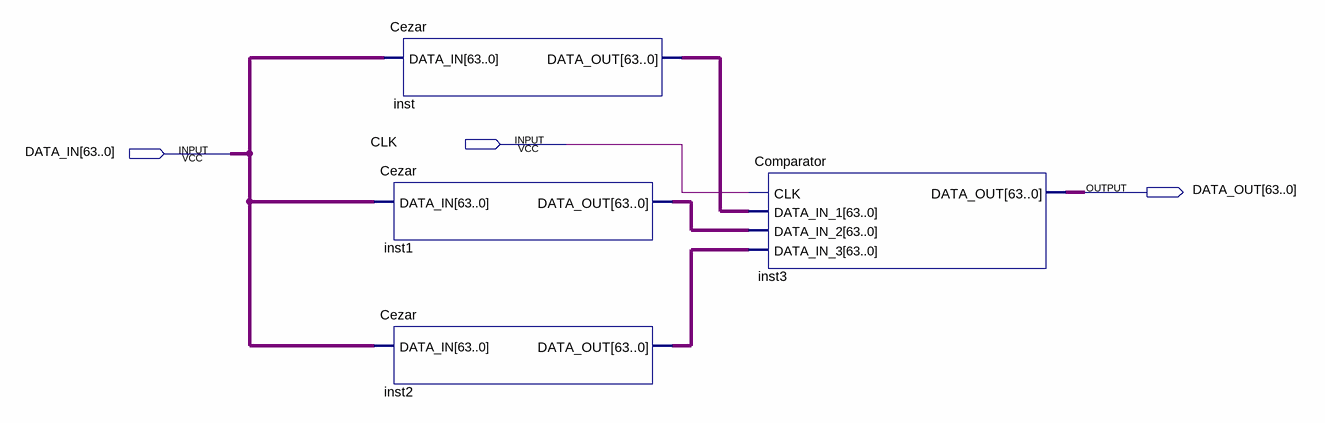
[diagram p0: schematic sheet]
// Quartus schematic schemat.bdf as structural Verilog: 4 symbols, 3 pins
module schemat (
  input  CLK,
  input  [63:0] DATA_IN,
  output [63:0] DATA_OUT
);

  wire [63:0] inst1_data_out, inst2_data_out, inst_data_out;

  Cezar inst (.DATA_IN(DATA_IN), .DATA_OUT(inst_data_out));
  Cezar inst1 (.DATA_IN(DATA_IN), .DATA_OUT(inst1_data_out));
  Cezar inst2 (.DATA_IN(DATA_IN), .DATA_OUT(inst2_data_out));
  Comparator inst3 (
    .CLK(CLK), .DATA_IN_1(inst_data_out), .DATA_IN_2(inst1_data_out), .DATA_IN_3(inst2_data_out),
    .DATA_OUT(DATA_OUT));
endmodule
